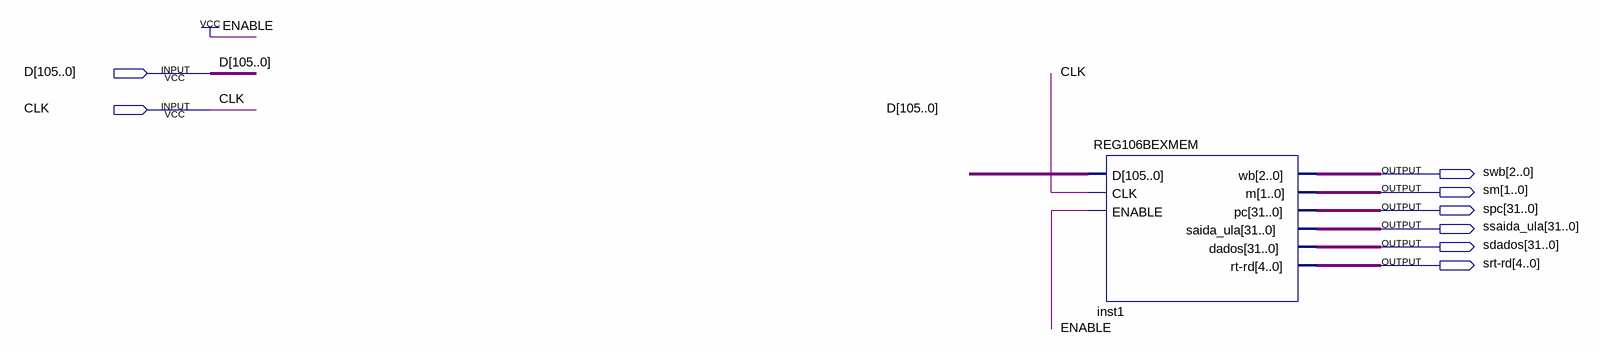
[diagram p0: schematic sheet]
// Quartus schematic EX-MEM.bdf as structural Verilog: 1 symbols, 8 pins
module \EX-MEM  (
  input  [105:0] D,
  input  CLK,
  output [2:0] swb,
  output [1:0] sm,
  output [31:0] spc,
  output [31:0] ssaida_ula,
  output [31:0] sdados,
  output [4:0] \srt-rd 
);

  REG106BEXMEM inst1 (
    .D(D), .CLK(CLK), .ENABLE(1'b1), .wb(swb), .m(sm), .pc(spc), .saida_ula(ssaida_ula), .dados(sdados),
    .\rt-rd (\srt-rd ));
endmodule
